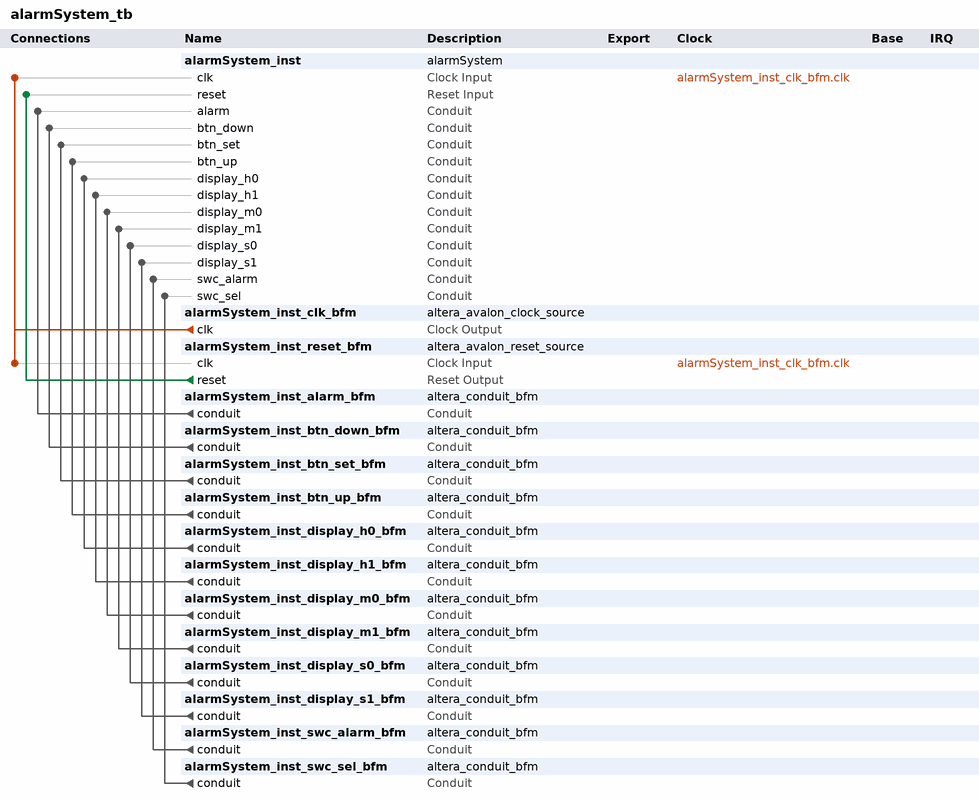
[diagram p0: system contents]
# Platform Designer (Qsys) system alarmSystem_tb, Cyclone V 5CSEMA5F31C6
# Parameters at their usual value, and those the tool derives, are not listed.
package require -exact qsys 20.1
create_system alarmSystem_tb
set_project_property DEVICE_FAMILY {Cyclone V}
set_project_property DEVICE 5CSEMA5F31C6

add_instance alarmSystem_inst alarmSystem 1.0

add_instance alarmSystem_inst_clk_bfm altera_avalon_clock_source 20.1

add_instance alarmSystem_inst_reset_bfm altera_avalon_reset_source 20.1
set_instance_parameter_value alarmSystem_inst_reset_bfm ASSERT_HIGH_RESET 0
set_instance_parameter_value alarmSystem_inst_reset_bfm INITIAL_RESET_CYCLES 50

add_instance alarmSystem_inst_alarm_bfm altera_conduit_bfm 20.1
set_instance_parameter_value alarmSystem_inst_alarm_bfm CLOCKED_SIGNAL false
set_instance_parameter_value alarmSystem_inst_alarm_bfm ENABLE_RESET false
set_instance_parameter_value alarmSystem_inst_alarm_bfm SIGNAL_DIRECTIONS input
set_instance_parameter_value alarmSystem_inst_alarm_bfm SIGNAL_WIDTHS 1

add_instance alarmSystem_inst_btn_down_bfm altera_conduit_bfm 20.1
set_instance_parameter_value alarmSystem_inst_btn_down_bfm CLOCKED_SIGNAL false
set_instance_parameter_value alarmSystem_inst_btn_down_bfm ENABLE_RESET false
set_instance_parameter_value alarmSystem_inst_btn_down_bfm SIGNAL_DIRECTIONS output
set_instance_parameter_value alarmSystem_inst_btn_down_bfm SIGNAL_WIDTHS 1

add_instance alarmSystem_inst_btn_set_bfm altera_conduit_bfm 20.1
set_instance_parameter_value alarmSystem_inst_btn_set_bfm CLOCKED_SIGNAL false
set_instance_parameter_value alarmSystem_inst_btn_set_bfm ENABLE_RESET false
set_instance_parameter_value alarmSystem_inst_btn_set_bfm SIGNAL_DIRECTIONS output
set_instance_parameter_value alarmSystem_inst_btn_set_bfm SIGNAL_WIDTHS 1

add_instance alarmSystem_inst_btn_up_bfm altera_conduit_bfm 20.1
set_instance_parameter_value alarmSystem_inst_btn_up_bfm CLOCKED_SIGNAL false
set_instance_parameter_value alarmSystem_inst_btn_up_bfm ENABLE_RESET false
set_instance_parameter_value alarmSystem_inst_btn_up_bfm SIGNAL_DIRECTIONS output
set_instance_parameter_value alarmSystem_inst_btn_up_bfm SIGNAL_WIDTHS 1

add_instance alarmSystem_inst_display_h0_bfm altera_conduit_bfm 20.1
set_instance_parameter_value alarmSystem_inst_display_h0_bfm CLOCKED_SIGNAL false
set_instance_parameter_value alarmSystem_inst_display_h0_bfm ENABLE_RESET false
set_instance_parameter_value alarmSystem_inst_display_h0_bfm SIGNAL_DIRECTIONS input
set_instance_parameter_value alarmSystem_inst_display_h0_bfm SIGNAL_WIDTHS 8

add_instance alarmSystem_inst_display_h1_bfm altera_conduit_bfm 20.1
set_instance_parameter_value alarmSystem_inst_display_h1_bfm CLOCKED_SIGNAL false
set_instance_parameter_value alarmSystem_inst_display_h1_bfm ENABLE_RESET false
set_instance_parameter_value alarmSystem_inst_display_h1_bfm SIGNAL_DIRECTIONS input
set_instance_parameter_value alarmSystem_inst_display_h1_bfm SIGNAL_WIDTHS 8

add_instance alarmSystem_inst_display_m0_bfm altera_conduit_bfm 20.1
set_instance_parameter_value alarmSystem_inst_display_m0_bfm CLOCKED_SIGNAL false
set_instance_parameter_value alarmSystem_inst_display_m0_bfm ENABLE_RESET false
set_instance_parameter_value alarmSystem_inst_display_m0_bfm SIGNAL_DIRECTIONS input
set_instance_parameter_value alarmSystem_inst_display_m0_bfm SIGNAL_WIDTHS 8

add_instance alarmSystem_inst_display_m1_bfm altera_conduit_bfm 20.1
set_instance_parameter_value alarmSystem_inst_display_m1_bfm CLOCKED_SIGNAL false
set_instance_parameter_value alarmSystem_inst_display_m1_bfm ENABLE_RESET false
set_instance_parameter_value alarmSystem_inst_display_m1_bfm SIGNAL_DIRECTIONS input
set_instance_parameter_value alarmSystem_inst_display_m1_bfm SIGNAL_WIDTHS 8

add_instance alarmSystem_inst_display_s0_bfm altera_conduit_bfm 20.1
set_instance_parameter_value alarmSystem_inst_display_s0_bfm CLOCKED_SIGNAL false
set_instance_parameter_value alarmSystem_inst_display_s0_bfm ENABLE_RESET false
set_instance_parameter_value alarmSystem_inst_display_s0_bfm SIGNAL_DIRECTIONS input
set_instance_parameter_value alarmSystem_inst_display_s0_bfm SIGNAL_WIDTHS 8

add_instance alarmSystem_inst_display_s1_bfm altera_conduit_bfm 20.1
set_instance_parameter_value alarmSystem_inst_display_s1_bfm CLOCKED_SIGNAL false
set_instance_parameter_value alarmSystem_inst_display_s1_bfm ENABLE_RESET false
set_instance_parameter_value alarmSystem_inst_display_s1_bfm SIGNAL_DIRECTIONS input
set_instance_parameter_value alarmSystem_inst_display_s1_bfm SIGNAL_WIDTHS 8

add_instance alarmSystem_inst_swc_alarm_bfm altera_conduit_bfm 20.1
set_instance_parameter_value alarmSystem_inst_swc_alarm_bfm CLOCKED_SIGNAL false
set_instance_parameter_value alarmSystem_inst_swc_alarm_bfm ENABLE_RESET false
set_instance_parameter_value alarmSystem_inst_swc_alarm_bfm SIGNAL_DIRECTIONS output
set_instance_parameter_value alarmSystem_inst_swc_alarm_bfm SIGNAL_WIDTHS 1

add_instance alarmSystem_inst_swc_sel_bfm altera_conduit_bfm 20.1
set_instance_parameter_value alarmSystem_inst_swc_sel_bfm CLOCKED_SIGNAL false
set_instance_parameter_value alarmSystem_inst_swc_sel_bfm ENABLE_RESET false
set_instance_parameter_value alarmSystem_inst_swc_sel_bfm SIGNAL_DIRECTIONS output
set_instance_parameter_value alarmSystem_inst_swc_sel_bfm SIGNAL_WIDTHS 1

# connections
add_connection alarmSystem_inst_clk_bfm.clk alarmSystem_inst.clk clock
add_connection alarmSystem_inst_clk_bfm.clk alarmSystem_inst_reset_bfm.clk clock
add_connection alarmSystem_inst_reset_bfm.reset alarmSystem_inst.reset reset
add_connection alarmSystem_inst_alarm_bfm.conduit alarmSystem_inst.alarm conduit
add_connection alarmSystem_inst_btn_down_bfm.conduit alarmSystem_inst.btn_down conduit
add_connection alarmSystem_inst_btn_set_bfm.conduit alarmSystem_inst.btn_set conduit
add_connection alarmSystem_inst_btn_up_bfm.conduit alarmSystem_inst.btn_up conduit
add_connection alarmSystem_inst_display_h0_bfm.conduit alarmSystem_inst.display_h0 conduit
add_connection alarmSystem_inst_display_h1_bfm.conduit alarmSystem_inst.display_h1 conduit
add_connection alarmSystem_inst_display_m0_bfm.conduit alarmSystem_inst.display_m0 conduit
add_connection alarmSystem_inst_display_m1_bfm.conduit alarmSystem_inst.display_m1 conduit
add_connection alarmSystem_inst_display_s0_bfm.conduit alarmSystem_inst.display_s0 conduit
add_connection alarmSystem_inst_display_s1_bfm.conduit alarmSystem_inst.display_s1 conduit
add_connection alarmSystem_inst_swc_alarm_bfm.conduit alarmSystem_inst.swc_alarm conduit
add_connection alarmSystem_inst_swc_sel_bfm.conduit alarmSystem_inst.swc_sel conduit

set_interconnect_requirement {$system} qsys_mm.clockCrossingAdapter HANDSHAKE
set_interconnect_requirement {$system} qsys_mm.enableEccProtection FALSE
set_interconnect_requirement {$system} qsys_mm.insertDefaultSlave FALSE
set_interconnect_requirement {$system} qsys_mm.maxAdditionalLatency 1

save_system alarmSystem_tb.qsys
